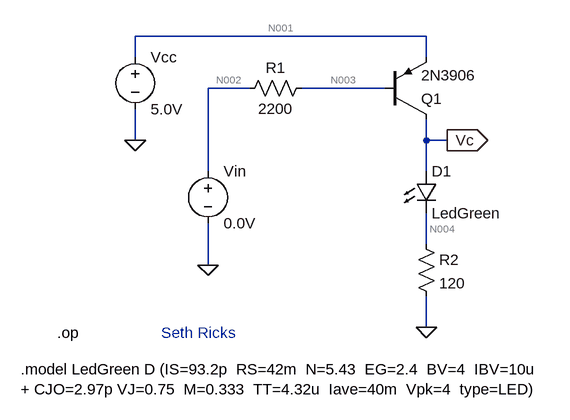
[diagram p0: schematic question_4.asc]
question_4.asc, the LTspice schematic file:
Version 4.1
SHEET 1 892 680
WIRE 640 -80 192 -80
WIRE 192 -48 192 -80
WIRE 640 -48 640 -80
WIRE 368 0 304 0
WIRE 576 0 448 0
WIRE 192 80 192 32
WIRE 640 80 640 48
WIRE 672 80 640 80
WIRE 304 128 304 0
WIRE 640 128 640 80
WIRE 640 240 640 192
WIRE 304 272 304 208
WIRE 640 368 640 320
FLAG 640 368 0
FLAG 304 272 0
FLAG 192 80 0
FLAG 672 80 Vc
IOPIN 672 80 Out
SYMBOL voltage 304 112 R0
SYMATTR InstName Vin
SYMATTR Value 0.0V
SYMBOL voltage 192 -64 R0
SYMATTR InstName Vcc
SYMATTR Value 5.0V
SYMBOL pnp 576 48 M180
SYMATTR InstName Q1
SYMATTR Value 2N3906
SYMBOL LED 624 128 R0
SYMATTR InstName D1
SYMATTR Value LedGreen
SYMBOL res 624 224 R0
SYMATTR InstName R2
SYMATTR Value 120
SYMBOL res 464 -16 R90
WINDOW 0 0 56 VBottom 2
WINDOW 3 32 56 VTop 2
SYMATTR InstName R1
SYMATTR Value 2200
TEXT 16 432 Left 2 !.model LedGreen D (IS=93.2p  RS=42m  N=5.43  EG=2.4  BV=4  IBV=10u  \n+ CJO=2.97p VJ=0.75  M=0.333  TT=4.32u  Iave=40m  Vpk=4  type=LED)
TEXT 72 376 Left 2 !.op
TEXT 232 376 Left 2 ;Seth Ricks

The netlist it stands for:
* question_4.asc
Vin N002 0 0.0V
Vcc N001 0 5.0V
Q1 Vc N003 N001 0 2N3906
D1 Vc N004 LedGreen
R2 N004 0 120
R1 N003 N002 2200
.model D D
.lib standard.dio
.model NPN NPN
.model PNP PNP
.lib standard.bjt
.model LedGreen D (IS=93.2p  RS=42m  N=5.43  EG=2.4  BV=4  IBV=10u
+ CJO=2.97p VJ=0.75  M=0.333  TT=4.32u  Iave=40m  Vpk=4  type=LED)
.op
* Seth Ricks
.backanno
.end

* Results of the author's LTspice run, read from the files saved beside the schematic
* Operating Point:
*   V(n001) = 5 V
*   V(n002) = 0 V
*   V(n003) = 4.217 V
*   V(n004) = 2.272 V
*   V(vc) = 4.959 V
*   I(D1) = 18.93 mA
*   I(R1) = 1.917 mA
*   I(R2) = 18.93 mA
*   I(Vcc) = -20.85 mA
*   I(Vin) = 1.917 mA
*   Ib(Q1) = -1.917 mA
*   Ic(Q1) = -18.93 mA
*   Ie(Q1) = 20.85 mA
*   Is(Q1) = 0 A